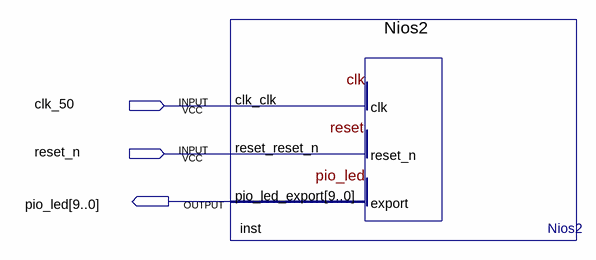
[diagram p0: schematic sheet]
// Quartus schematic Nios2_top.bdf as structural Verilog: 1 symbols, 3 pins
module Nios2_top (
  input  clk_50,
  input  reset_n,
  output [9:0] pio_led
);

  Nios2 inst (.clk_clk(clk_50), .reset_reset_n(reset_n), .pio_led_export(pio_led));
endmodule
